# Altium schematic sheet Digital_Clock_SCH.SchDoc
size A; SheetNumber: 1; SheetTotal: 2
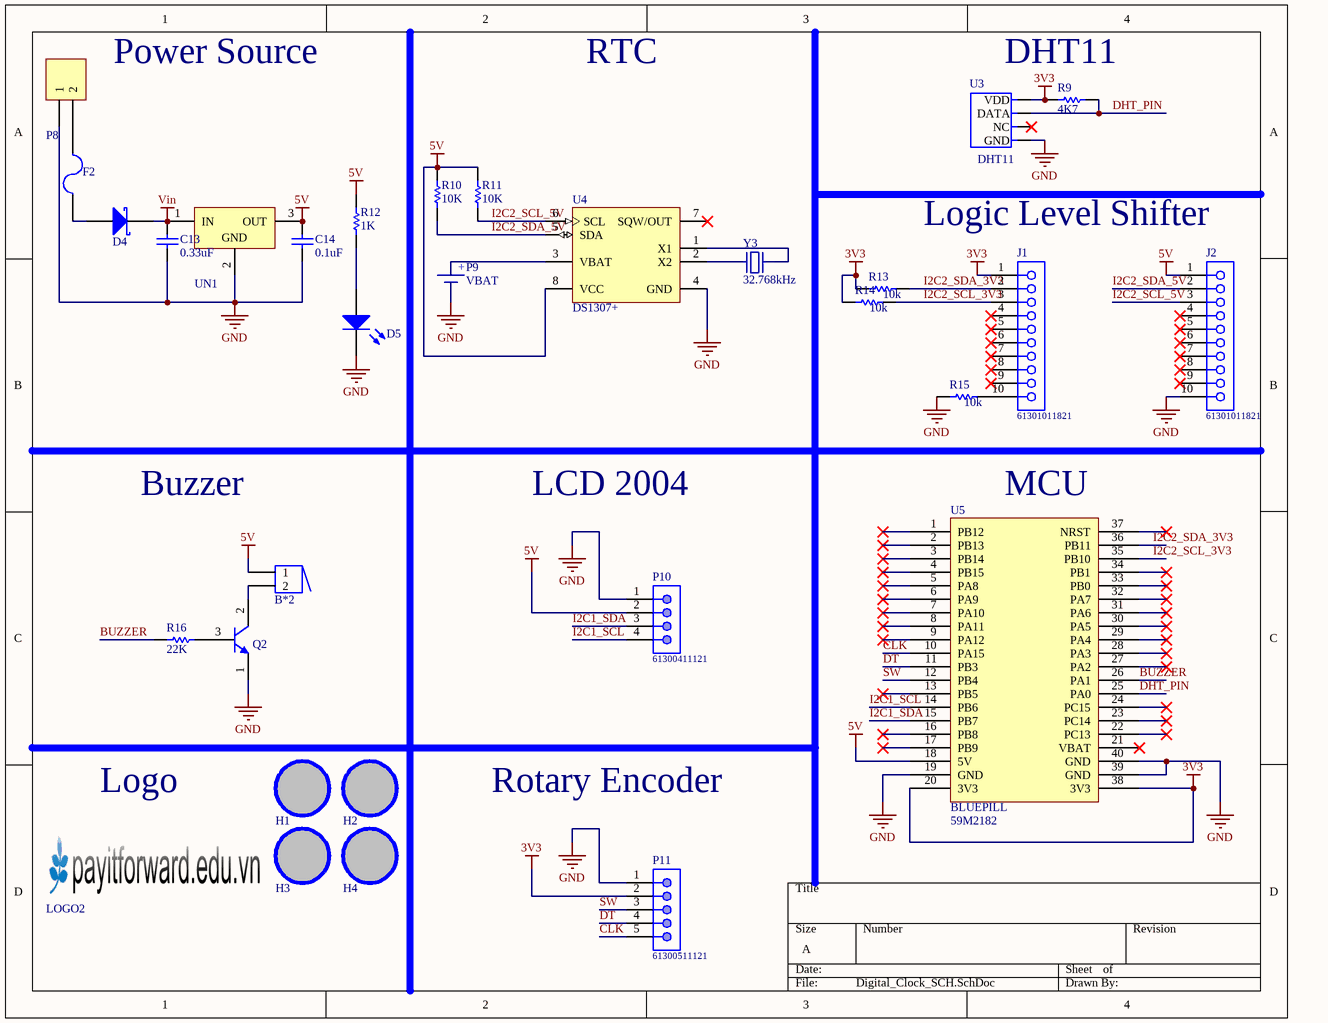
[diagram p0: Digital_Clock_SCH.SchDoc]

## Parts
B*2  Buzzer  [BUZZER]  (value not drawn)
C13  value 0.33uF  [CAP-SM-0805]  (hidden comment: Cap Non-Pol SMD)
C14  value 0.1uF  [CAP-SM-0805]  (hidden comment: Cap Non-Pol SMD)
D4  D Schottky  [SS34]  (value not drawn)
D5  LED  [LED-3mm]  (value not drawn)
F2  Fuse  [FUSE SMD]  (value not drawn)
H1  Hole  [LO KHOAN 3MM]  (value not drawn)
H2  Hole  [LO KHOAN 3MM]  (value not drawn)
H3  Hole  [LO KHOAN 3MM]  (value not drawn)
H4  Hole  [LO KHOAN 3MM]  (value not drawn)
J1  61301011821  [61301011821]
J2  61301011821  [61301011821]
LOGO2  LOGO PIF  [PIF LOGO SMALL TOP]  (value not drawn)
P8  Domino 2  [DOMINO SMALL 2]  (value not drawn)
P9  VBAT  [VBAT CR2030]
P10  61300411121  [61300411121]
P11  61300511121  [61300511121]
Q2  C1815  [QTO-92]  (value not drawn)
R9  value 4K7  [RES-SM-0805]  (hidden comment: RESISTOR SMD)
R10  value 10K  [RES-SM-0805]  (hidden comment: RESISTOR SMD)
R11  value 10K  [RES-SM-0805]  (hidden comment: RESISTOR SMD)
R12  value 1K  [RES-SM-0805]  (hidden comment: RESISTOR SMD)
R13  value 10k  [RES-SM-0805]  (hidden comment: RESISTOR SMD)
R14  value 10k  [RES-SM-0805]  (hidden comment: RESISTOR SMD)
R15  value 10k  [RES-SM-0805]  (hidden comment: RESISTOR SMD)
R16  value 22K  [RES-SM-0805]  (hidden comment: RESISTOR SMD)
U3  DHT11  [SNR4-2.54-15.5X12.0X5.5MM]
U4  DS1307+  [MAXM-P8-1]
U5  BLUEPILL  Supplier Part Number 1: 59M2182  [BLUEPILL]
UN1  LM7805  [QTO-220]  (value not drawn)
Y3  32.768kHz  [XTAL 32768 3x8]

## Nets
3V3: J1.1 P11.2 R9.1 R13.1 R14.1 U3.1(VDD) U5.20(3V3) U5.38(3V3)
5V: B*2.1 C14.2 J2.1 P10.2 R10.2 R11.2 R12.1 U4.8(VCC) U5.18(5V) UN1.3(OUT)
GND: C13.1 C14.1 D5.2(K) J2.10 P8.1 P9.2(+) P10.1 P11.1 Q2.1(E) R15.1 U3.4(GND) U4.4(GND) U5.19(GND) U5.39(GND) U5.40(GND) UN1.2(GND)
Vin: C13.2 D4.2(K) UN1.1(IN)
BUZZER: R16.1 U5.26(PA1)
CLK: P11.5 U5.10(PA15)
DHT_PIN: R9.2 U3.2(DATA) U5.25(PA0)
DT: P11.4 U5.11(PB3)
I2C1_SCL: P10.4 U5.14(PB6)
I2C1_SDA: P10.3 U5.15(PB7)
I2C2_SCL_3V3: J1.3 R14.2 U5.35(PB10)
I2C2_SCL_5V: J2.3 R11.1 U4.6(SCL)
I2C2_SDA_3V3: J1.2 R13.2 U5.36(PB11)
I2C2_SDA_5V: J2.2 R10.1 U4.5(SDA)
SW: P11.3 U5.12(PB4)
NetB*2_2: B*2.2 Q2.2(C)
NetD4_1: D4.1(A) F2.2
NetD5_1: D5.1(A) R12.2
NetF2_1: F2.1 P8.2
NetJ1_10: J1.10 R15.2
NetP9_1: P9.1(+) U4.3(VBAT)
NetQ2_3: Q2.3(B) R16.2
NetU4_1: U4.1(X1) Y3.2
NetU4_2: U4.2(X2) Y3.1

Not connected (* = marked no-connect by the designer): H1 1; H2 1; H3 1; H4 1; J1 4* 5* 6* 7* 8* 9*; J2 4* 5* 6* 7* 8* 9*; U3 3(NC)*; U4 7(SQW/OUT)*; U5 1(PB12)* 2(PB13)* 3(PB14)* 4(PB15)* 5(PA8)* 6(PA9)* 7(PA10)* 8(PA11)* 9(PA12)* 13(PB5)* 16(PB8)* 17(PB9)* 21(VBAT)* 22(PC13)* 23(PC14)* 24(PC15)* 27(PA2)* 28(PA3)* 29(PA4)* 30(PA5)* 31(PA6)* 32(PA7)* 33(PB0)* 34(PB1)* 37(NRST)*

## Notes on the sheet
- (near P8) Power Source
- RTC
- DHT11
- Logic Level Shifter
- Buzzer
- LCD 2004
- (near U5) MCU
- Logo
- Rotary Encoder

## Library data of the parts
C13 C14 = Cap Non-Pol SMD: Capacitor
D4 = D Schottky: Schottky Diode; Published: 8-Jun-2000; LatestRevisionDate: 17-Jul-2002; LatestRevisionNote: Re-released for DXP Platform.; PackageReference: SMB; Publisher: Altium Limited; PackageDescription: DO-214-AA/SMB; 2 C-Bend Leads; Body 5.3 x 3.6 mm, inc. leads (LxW); Code_JEDEC: DO-214-AA
H1-H4 = Hole: Hole 3mm
J1 J2 = 61301011821: WR-PHD Socket Header, THT, pitch 2.54mm, Single Row, Vertical, 10p; Manufacturer: Wurth Elektronik; Pin Number: 10; Rated Current: 3A; Working Voltage: 250VAC; Withstanding Voltage: 500VAC; Contact Resistance: 20mOhm; ComponentLink1Description: Manufacturer; ComponentLink1URL: http://www.we-online.de; ComponentLink2Description: Datasheet; ComponentLink2URL: https://www.we-online.com/catalog/datasheet/61301011821.pdf; Manufacturer Part Number: 61301011821; Published Date: May 2020; Pitch: 2.54mm; Operating Temperature: -40 to +125degC; Mounting Technology: THT; Packaging: Tray; Gender: Socket Header; Row Number: Single; Orientation: Vertical
P8 = Domino 2: Domino, 2-Pin; LatestRevisionDate: 17-Jul-2002; LatestRevisionNote: Re-released for DXP Platform.; Publisher: Altium Limited
P9 = VBAT CR2032: CR2032; Manufacturer: DANTONA INDUSTRIES; Manufacturer Part Number: CR2032 SANYO; Supplier 1: Newark; RoHS: NA; Stock 1: 1694; Pricing 1: 1=0.768, 5=0.655, 10=0.615, 25=0.565, 50=0.51, 100=0.46, 250=0.41 (USD); ComponentLink1URL: http://www.farnell.com/datasheets/1797668.pdf; ComponentLink1Description: http://www.farnell.com/datasheets/1797668.pdf; ComponentLink2URL: /datasheets/DANTONA/CRSANYO.pdf; ComponentLink2Description: /datasheets/DANTONA/CRSANYO.pdf
P10 = 61300411121: WR-PHD Pin Header, THT, pitch 2.54mm, Single Row, Vertical, 4p; Manufacturer: Wurth Elektronik; Pin Number: 4; Rated Current: 3A; Working Voltage: 250VAC; Withstanding Voltage: 500VAC; Contact Resistance: 20mOhm; ComponentLink1Description: Manufacturer; ComponentLink1URL: http://www.we-online.de; ComponentLink2Description: Datasheet; ComponentLink2URL: https://www.we-online.com/catalog/datasheet/61300411121.pdf; Manufacturer Part Number: 61300411121; Published Date: May 2020; Pitch: 2.54mm; Operating Temperature: -40 to +105degC; Mounting Technology: THT; Packaging: Bag; Gender: Pin Header; Row Number: Single; Orientation: Vertical
P11 = 61300511121: WR-PHD Pin Header, THT, pitch 2.54mm, Single Row, Vertical, 5p; Manufacturer: Wurth Elektronik; Pin Number: 5; Rated Current: 3A; Working Voltage: 250VAC; Withstanding Voltage: 500VAC; Contact Resistance: 20mOhm; ComponentLink1Description: Manufacturer; ComponentLink1URL: http://www.we-online.de; ComponentLink2Description: Datasheet; ComponentLink2URL: https://www.we-online.com/catalog/datasheet/61300511121.pdf; Manufacturer Part Number: 61300511121; Published Date: May 2020; Pitch: 2.54mm; Operating Temperature: -40 to +105degC; Mounting Technology: THT; Packaging: Bag; Gender: Pin Header; Row Number: Single; Orientation: Vertical
Q2 = C1815: NPN Bipolar Transistor
R9-R16 = RESISTOR SMD: Resistor
U3 = TEM-HUM-DHT11(4P-15.5X12.0MM): Servo AC 100 ~ 120VAC Supply 10A 120V Load; MF: Panasonic Industrial Automation Sales; MP: DHT11; Package: None; SnapEDA_Link: https://www.snapeda.com/parts/DHT11/Panasonic/view-part/6618018/?ref=snap; Check_prices: https://www.snapeda.com/parts/DHT11/Panasonic/view-part/6618018/?ref=eda; Availability: In Stock; Value: *; Price: None; Purchase-URL: https://pricing.snapeda.com/search/part/DHT11/?ref=eda
U4 = CMP-016-00004-3: I2C Real-Time Clock, 5 V, 0 to 70 degC, 8-Pin DIP, RoHS, Tube; Manufacturer: Maxim; Min Supply Voltage: 4.5V; Interface: Serial; Nominal Supply Voltage: 5V; Package Version: Rev. E, 04/2011; Max Supply Voltage: 5.5V; RoHS Compliant: True; Manufacturer URL: http://www.maximintegrated.com/; Datasheet Version: Rev. 100208, 10/2008; Datasheet URL: https://datasheet.ciiva.com/20167/82-0567-20167410.pdf; Mounting Technology: TH; Package Quantity: 50; Packaging: Rail/Tube; Package Description: 8-Pin Plastic Dual-In-Line, Narrow (0.3in) (P8-1), Body 9.375 x 6.985 mm, Pitch 2.54 mm; Case/Package: DIP; Min Operating Temperature: 0°C; Package URL: http://pdfserv.maximintegrated.com/package_dwgs/21-0043.PDF; Pins: 8; Max Operating Temperature: 70°C; Package Reference: P8-1
U5 = BLUEPILL: Development board STM32F103C8T6; Supplier 1: Newark
UN1 = LM7805: Positive Voltage Regulator
Y3 = XTAL: Crystal For all Crystal 2pin